# EAGLE schematic midi_block_template (EAGLE 6.6.0)
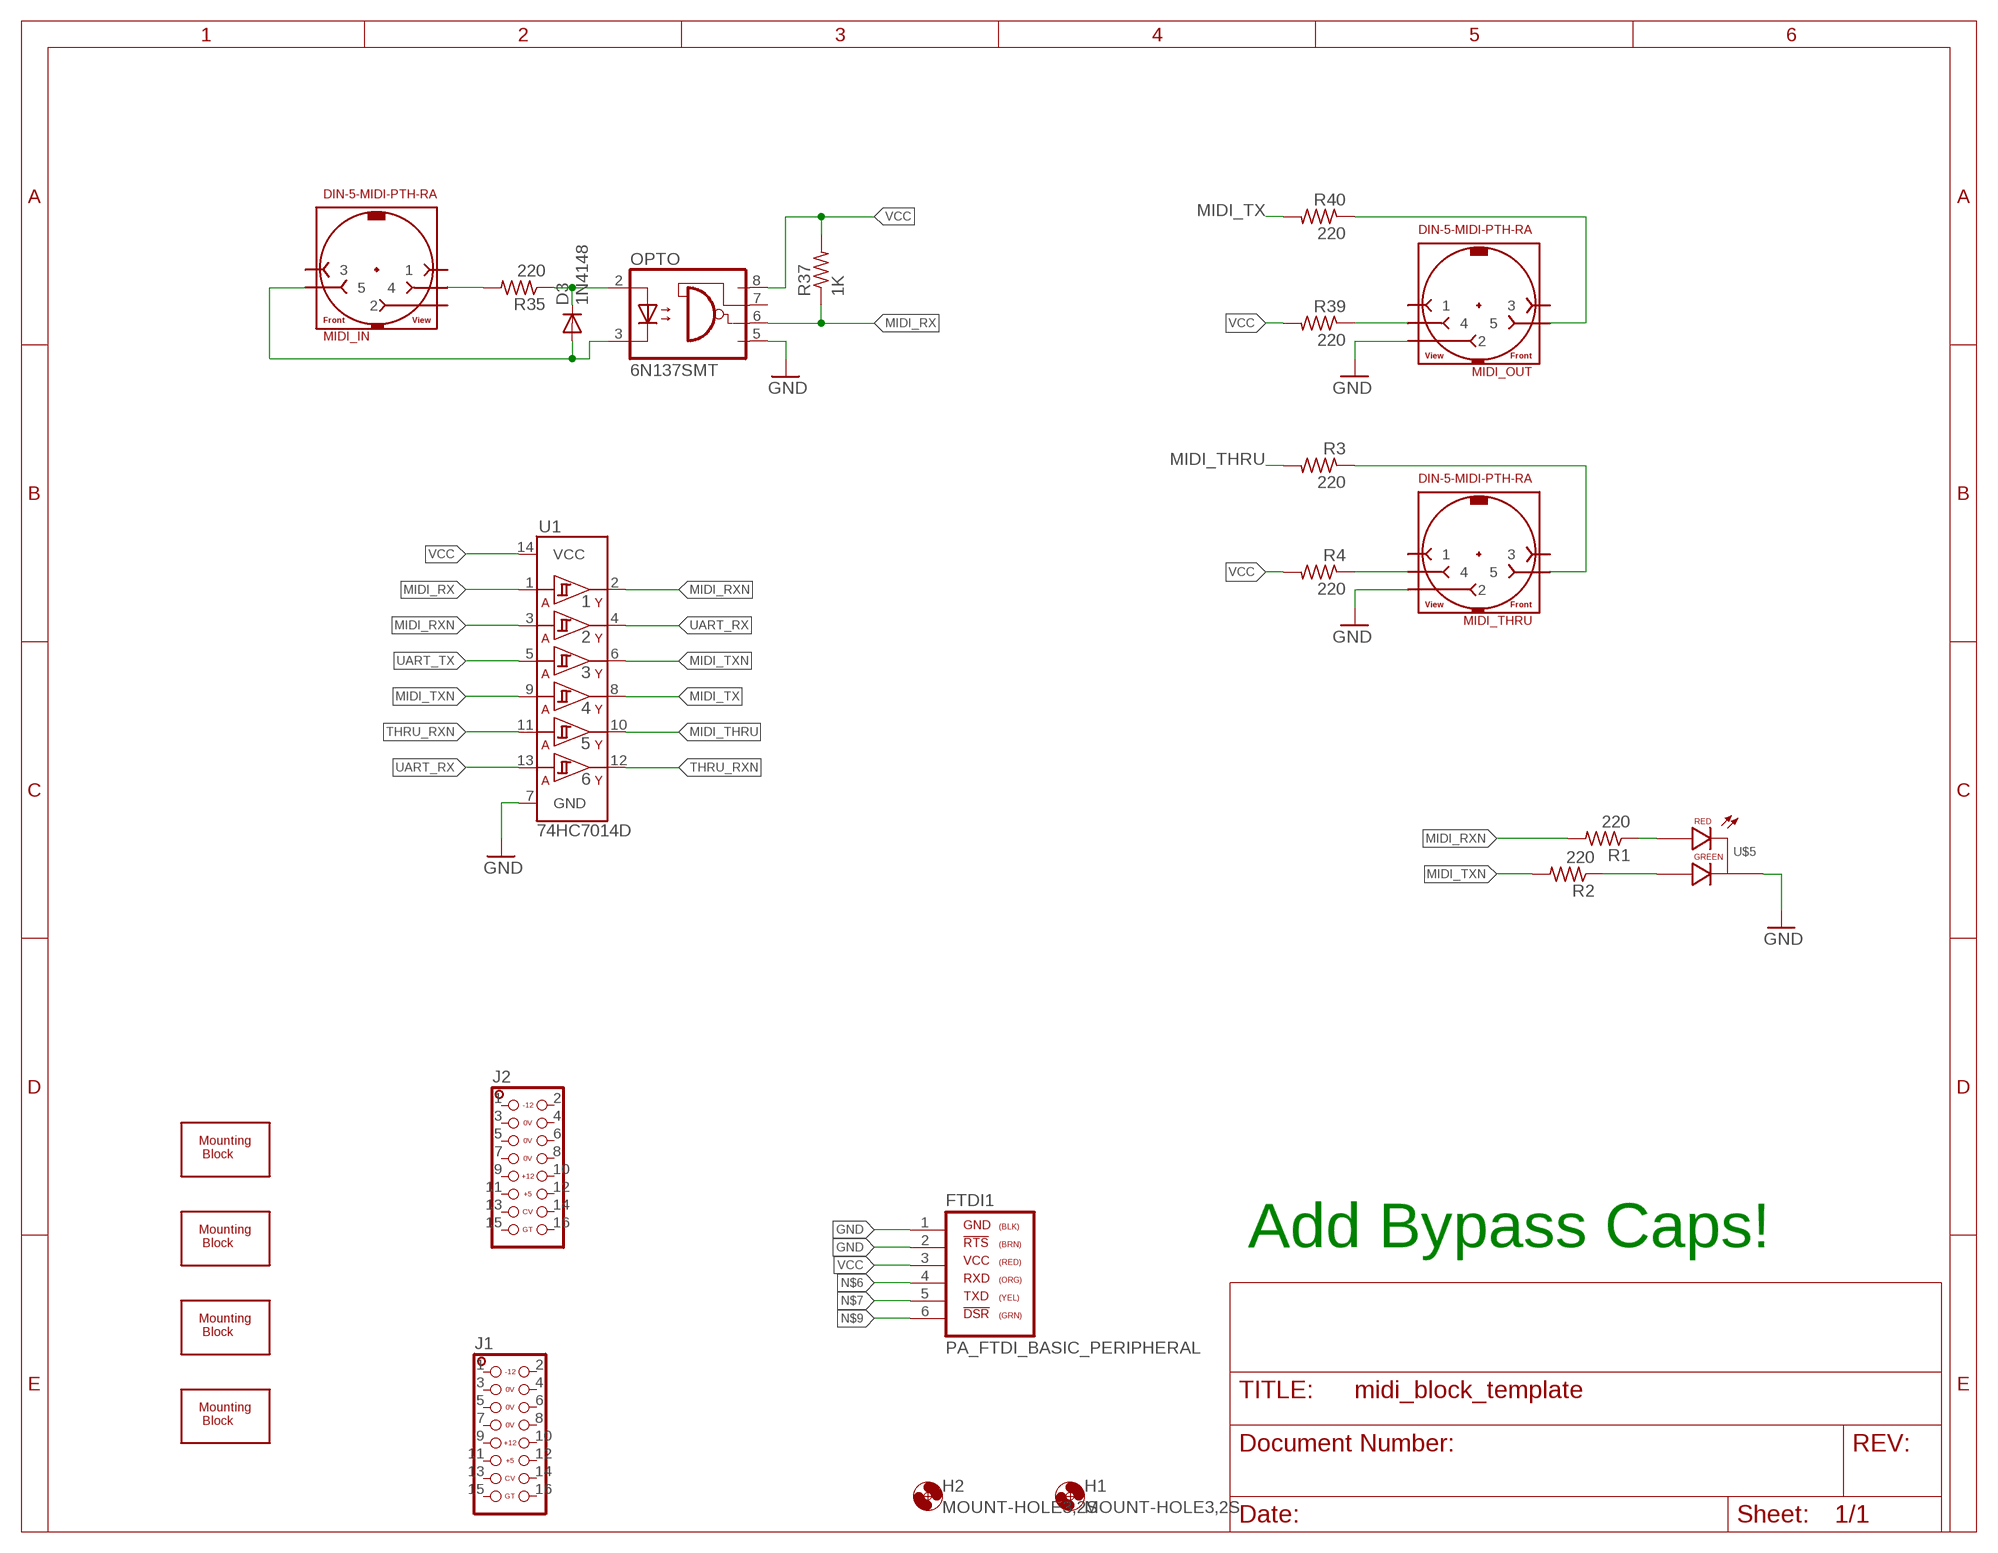
[diagram p0: schematic, sheet 1]

## Parts
D3  1N4148  DIODE-SOD323-W  [SOD323-W]
FTDI1  PA_FTDI_BASIC_PERIPHERAL  [PA_PMOD_SIL_MALE]
H1  MOUNT-HOLE3,2S  [3,2,SMALL]
H2  MOUNT-HOLE3,2S  [3,2,SMALL]
J1  EUROPWR_2X08-SHROUD  [2X08_EUROPWR_SHROUD]
J2  EUROPWR_2X08-SHROUD  [2X08_EUROPWR_SHROUD]
MIDI_IN  DIN-5-MIDI-PTH-RA  [DIN-5-PTH-RA-SUPPORT]
MIDI_OUT  DIN-5-MIDI-PTH-RA  [DIN-5-PTH-RA-SUPPORT]
MIDI_THRU  DIN-5-MIDI-PTH-RA  [DIN-5-PTH-RA-SUPPORT]
OPTO  6N137SMT  [DIL8-SMD]
R1  220  R-US_R0603  [R0603]
R2  220  R-US_R0603  [R0603]
R3  220  R-US_R0603  [R0603]
R4  220  R-US_R0603  [R0603]
R35  220  R-US_R0603  [R0603]
R37  1K  R-US_R0603  [R0603]
R39  220  R-US_R0603  [R0603]
R40  220  R-US_R0603  [R0603]
U1  74HC7014D  [SOIC-14]
U$1  PCB-MB-SIDE  [PCB-MB-01-SIDE]
U$2  PCB-MB-SIDE  [PCB-MB-01-SIDE]
U$3  PCB-MB-SIDE  [PCB-MB-01-SIDE]
U$4  PCB-MB-SIDE  [PCB-MB-01-SIDE]
U$5  LED-RG-CC-PTH-G18500  [LED-RG-PANEL]

## Nets
CL_IN: MIDI_IN.4 R35.2
GND: FTDI1.1 FTDI1.2 MIDI_OUT.2 MIDI_THRU.2 OPTO.5(GND) U1.7(GND) U$5.CC(CATHODE)
MIDI_IN: D3.A MIDI_IN.5 OPTO.3(C)
MIDI_OUT: MIDI_OUT.5 R40.1
MIDI_OUT1: MIDI_THRU.5 R3.1
MIDI_RX: OPTO.6(VO) R37.1 U1.1(1A)
MIDI_RXN: R1.2 U1.2(1Y) U1.3(2A)
MIDI_THRU: R3.2 U1.10(5Y)
MIDI_TX: R40.2 U1.8(4Y)
MIDI_TXN: R2.2 U1.6(3Y) U1.9(4A)
N$1: R1.1 U$5.RED(RED_CATHODE)
N$2: R2.1 U$5.GREEN(GREEN_CATHODE)
N$3: MIDI_THRU.4 R4.1
N$6: FTDI1.4
N$7: FTDI1.5
N$8: D3.C OPTO.2(A) R35.1
N$9: FTDI1.6
N$13: MIDI_OUT.4 R39.1
THRU_RXN: U1.11(5A) U1.12(6Y)
UART_RX: U1.4(2Y) U1.13(6A)
UART_TX: U1.5(3A)
VCC: FTDI1.3 OPTO.8(VCC) R4.2 R37.2 R39.2 U1.14(VCC)
Unconnected: J1.1 J1.2 J1.3 J1.4 J1.5 J1.6 J1.7 J1.8 J1.9 J1.10 J1.11 J1.12 J1.13 J1.14 J1.15 J1.16 J2.1 J2.2 J2.3 J2.4 J2.5 J2.6 J2.7 J2.8 J2.9 J2.10 J2.11 J2.12 J2.13 J2.14 J2.15 J2.16 MIDI_IN.1 MIDI_IN.2 MIDI_IN.3 MIDI_OUT.1 MIDI_OUT.3 MIDI_THRU.1 MIDI_THRU.3 OPTO.7(VE)

## Notes on the sheet
- Add Bypass Caps!

## Library data of the parts
D3 = diode:DIODE-: DIODE
FTDI1 = PatternAgents-Interface:PA_FTDI_BASIC_PERIPHERAL: PatternAgents FTDI UART BASIC Pattern Pinout for Peripherals that connect to the "BASIC" FTDI USB-UART adaptor from Sparkfun and others. Source LBR : http://www.patternagents.com Github : https://github.com/patternagents Source Data : http://www.sparkfun.com/datasheets/DevTools/Arduino/FTDI%20Basic-v21-5V.pdf PA Pattern License : http://creativecommons.org/licenses/by-sa/4.0/ (Creative Commons 4.0) THIS SOFTWARE IS PROVIDED BY THE CONTRIBUTORS "AS IS" AND WITHOUT ANY EXPRESS OR IMPLIED WARRANTIES, INCLUDING, BUT NOT LIMITED TO, THE IMPLIED WARRANTIES OF MERCHANTABILITY AND FITNESS FOR A PARTICULAR PURPOSE ARE DISCLAIMED. IN NO EVENT SHALL THE COPYRIGHT OWNER OR CONTRIBUTORS BE LIABLE FOR ANY DIRECT, INDIRECT, INCIDENTAL, SPECIAL, EXEMPLARY, OR CONSEQUENTIAL DAMAGES (INCLUDING, BUT NOT LIMITED TO, PROCUREMENT OF SUBSTITUTE GOODS OR SERVICES; LOSS OF USE, DATA, OR PROFITS; OR BUSINESS INTERRUPTION) HOWEVER CAUSED AND ON ANY THEORY OF LIABILITY, WHETHER IN CONTRACT, STRICT LIABILITY, OR TORT (INCLUDING NEGLIGENCE OR OTHERWISE) ARISING IN ANY WAY OUT OF THE USE OF THIS SOFTWARE, EVEN IF ADVISED OF THE POSSIBILITY OF SUCH DAMAGE.
H1 H2 = oXo_Hardware:MOUNT-HOLE: MOUNTING HOLE with drill center marker
J1 J2 = halcyonmod_Connectors:EUROPWR_2X08: 2x08 pin header
MIDI_IN MIDI_OUT MIDI_THRU = oXo_connectors:DIN-5-MIDI: DIN-5 (MIDI) connector
OPTO = og-optocouplers:6N137: MOTOROLA OPTO COUPLER
R1-R4 R35 R37 R39 R40 = rcl:R-US_: RESISTOR, American symbol
U1 = SparkFun-DigitalIC:74HC7014D: The 74HC7014 is a hex buffer with precision Schmitt-trigger inputs. The precisely defined trigger levels are lying in a window between (0.55 x VCC) and (0.65 x VCC). It makes the circuit suitable to operate in a highly noisy environment. Input shorts are allowed to -1.5 V and +16 V without disturbing other channels. Inputs include clamp diodes that enable the use of current limiting resistors to interface inputs to voltages in excess of VCC. Schmitt trigger inputs transform slowly changing input signals into sharply defined jitter-free output signals.; PROD_ID: IC-12527
U$1-U$4 = halcyonmod_Hardware:PCB-MB: Mounting Block Hardware Attaches two PCB's at a Right Angle using #4 Self-Threading Screws Source: http://www.essentracomponents.com.sg/images-line/pdfs/PCB-MB.pdf
U$5 = halcyonmod_Optoelectronics:LED-RG-CC-PTH: LED Red/Green Common Cathode Pin Through Hole